# EAGLE design CBMINI (EAGLE 9.5.1)
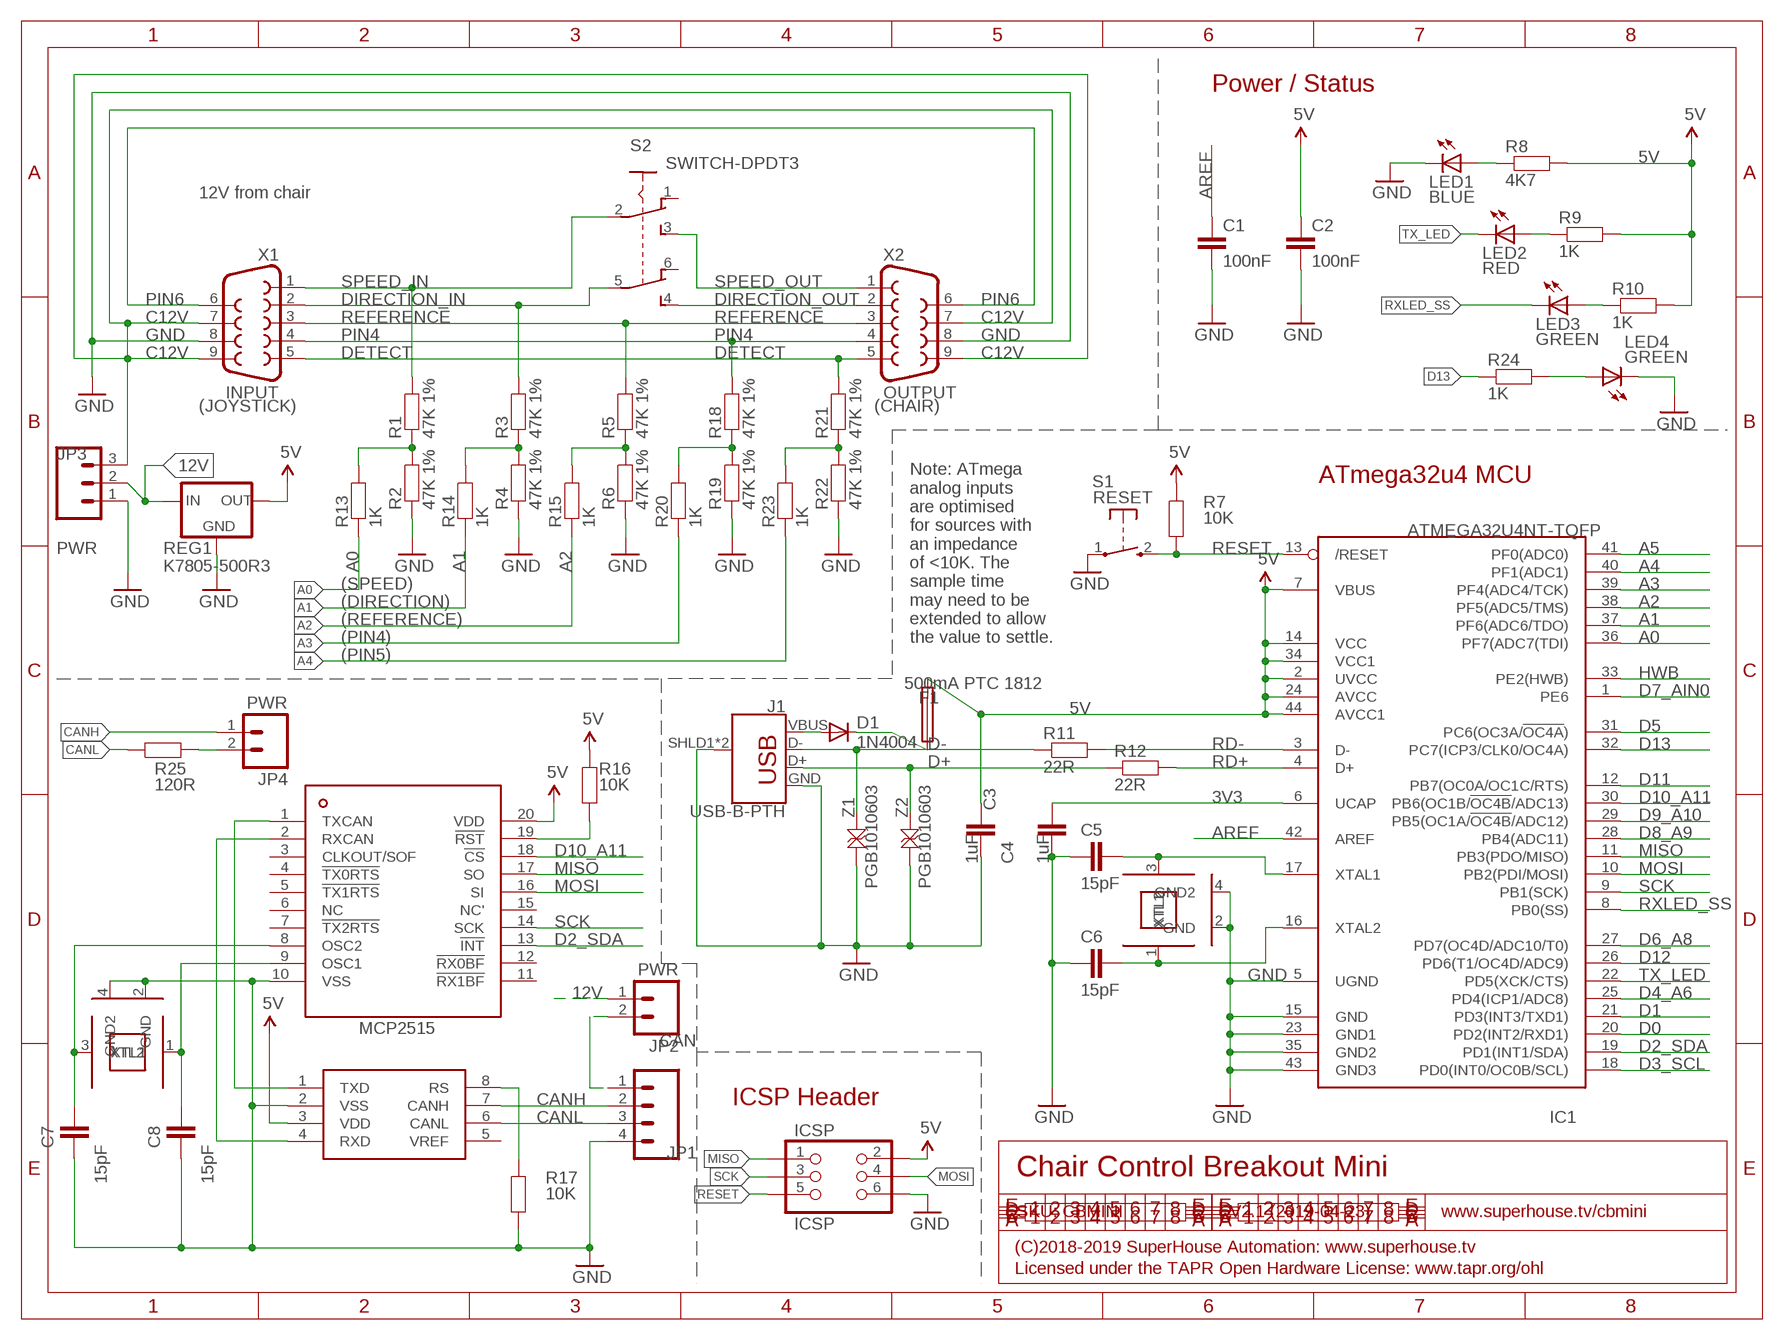
[diagram p0: schematic, sheet 1]

## Parts
C1  100nF  CAP0603  [C0603]
C2  100nF  CAP0603  [C0603]
C3  1uF  CAP0603  [C0603]
C4  1uF  CAP0603  [C0603]
C5  15pF  CAP0603  [C0603]
C6  15pF  CAP0603  [C0603]
C7  15pF  CAP0603  [C0603]
C8  15pF  CAP0603  [C0603]
D1  1N4004  DIODESMA  [SMA-DIODE]
F1  500mA PTC 1812  PTC050  [1812]
IC1  ATMEGA32U4NT-TQFP  [TQFP44]
IC2  MCP2515  [TSSOP20]
IC3  MCP2551  [SO08]
ICSP  ICSP  ICSP-PIN  [2X03-ICSP]
J1  USB-B-PTH  [USB-B-PTH]
JP1  CAN  M04-PIN  [1X04-P]
JP2  PWR  M02-PIN  [1X02-P]
JP3  PWR  M03-PIN  [1X03-P]
JP4  PWR  M02-PIN  [1X02-P]
LED1  BLUE  LED0603  [LED-0603]
LED2  RED  LED0603  [LED-0603]
LED3  GREEN  LED0603  [LED-0603]
LED4  GREEN  LED0603  [LED-0603]
R1  47K 1%  RESISTOR0603  [R0603]
R2  47K 1%  RESISTOR0603  [R0603]
R3  47K 1%  RESISTOR0603  [R0603]
R4  47K 1%  RESISTOR0603  [R0603]
R5  47K 1%  RESISTOR0603  [R0603]
R6  47K 1%  RESISTOR0603  [R0603]
R7  10K  RESISTOR0603  [R0603]
R8  4K7  RESISTOR0603  [R0603]
R9  1K  RESISTOR0603  [R0603]
R10  1K  RESISTOR0603  [R0603]
R11  22R  RESISTOR0603  [R0603]
R12  22R  RESISTOR0603  [R0603]
R13  1K  RESISTOR0603  [R0603]
R14  1K  RESISTOR0603  [R0603]
R15  1K  RESISTOR0603  [R0603]
R16  10K  RESISTOR0603  [R0603]
R17  10K  RESISTOR0603  [R0603]
R18  47K 1%  RESISTOR0603  [R0603]
R19  47K 1%  RESISTOR0603  [R0603]
R20  1K  RESISTOR0603  [R0603]
R21  47K 1%  RESISTOR0603  [R0603]
R22  47K 1%  RESISTOR0603  [R0603]
R23  1K  RESISTOR0603  [R0603]
R24  1K  RESISTOR0603  [R0603]
R25  120R  RESISTOR0603  [R0603]
REG1  K7805-500R3  K78XX-500R3  [K78XX-500R3]
S1  RESET  TAC_SWITCH_2PINSMT  [TACTILE_SMT_3X4X2]
S2  SWITCH-DPDT3  [7201SD9AV2BE]
X1  INPUT  DB9MALE  [DB9_MALE]
X2  OUTPUT  DB9FEMALE  [DB9]
XTL1  16MHz  CRYSTAL-GND3X2  [CRYSTAL-SMD-3X2]
XTL2  16MHz  CRYSTAL-GND3X2  [CRYSTAL-SMD-3X2]
Z1  PGB1010603  TVS0603  [TVS0603]
Z2  PGB1010603  TVS0603  [TVS0603]

## Nets
3V3: C4.2 IC1.6(UCAP)
5V: C2.1 C3.1 F1.2 IC1.2(UVCC) IC1.7(VBUS) IC1.14(VCC) IC1.24(AVCC) IC1.34(VCC1) IC1.44(AVCC1) IC2.20(VDD) IC3.3(VDD) ICSP.2 R7.2 R8.2 R9.2 R10.2 R16.2 REG1.3(OUT)
12V: JP2.1 JP3.2 REG1.1(IN)
A0: IC1.36(PF7(ADC7(TDI)) R13.1
A1: IC1.37(PF6(ADC6/TDO)) R14.1
A2: IC1.38(PF5(ADC5/TMS)) R15.1
A3: IC1.39(PF4(ADC4/TCK)) R20.1
A4: IC1.40(PF1(ADC1)) R23.1
A5: IC1.41(PF0(ADC0))
AREF: C1.1 IC1.42(AREF)
C12V: JP3.3 X1.7 X1.9 X2.7 X2.9
CANH: IC3.7(CANH) JP1.2 JP4.1
CANL: IC3.6(CANL) JP1.3 R25.1
D0: IC1.20(PD2(INT2/RXD1))
D1: IC1.21(PD3(INT3/TXD1))
D2_SDA: IC1.19(PD1(INT1/SDA)) IC2.13(!INT)
D3_SCL: IC1.18(PD0(INT0/OC0B/SCL))
D4_A6: IC1.25(PD4(ICP1/ADC8))
D5: IC1.31(PC6(OC3A/!OC4A!))
D6_A8: IC1.27(PD7(OC4D/ADC10/T0))
D7_AIN0: IC1.1(PE6)
D8_A9: IC1.28(PB4(ADC11))
D9_A10: IC1.29(PB5(OC1A/!OC4B!/ADC12))
D10_A11: IC1.30(PB6(OC1B/!OC4B!/ADC13)) IC2.18(!CS)
D11: IC1.12(PB7(OC0A/OC1C/RTS))
D12: IC1.26(PD6(T1/OC4D/ADC9))
D13: IC1.32(PC7(ICP3/CLK0/OC4A)) R24.1
D+: J1.D+ R12.1 Z2.2
D-: J1.D- R11.1 Z1.2
DETECT: R21.2 X1.5 X2.5
DIRECTION_IN: R3.2 S2.5 X1.2
DIRECTION_OUT: S2.4 X2.2
GND: C1.2 C2.2 C3.2 C4.1 C5.1 C6.1 C7.1 C8.1 IC1.5(UGND) IC1.15(GND) IC1.23(GND1) IC1.35(GND2) IC1.43(GND3) IC2.10(VSS) IC3.2(VSS) ICSP.6 J1.GND J1.SHLD1(SHIELD) J1.SHLD2(SHIELD) JP1.4 JP3.1 LED1.C LED4.C R2.1 R4.1 R6.1 R17.1 R19.1 R22.1 REG1.2(GND) S1.1(P) X1.8 X2.8 XTL1.2(GND) XTL1.4(GND2) XTL2.2(GND) XTL2.4(GND2) Z1.1 Z2.1
HWB: IC1.33(PE2(HWB))
MISO: IC1.11(PB3(PDO/MISO)) IC2.17(SO) ICSP.1
MOSI: IC1.10(PB2(PDI/MOSI)) IC2.16(SI) ICSP.4
N$1: LED4.A R24.2
N$2: R1.1 R2.2 R13.2
N$3: R3.1 R4.2 R14.2
N$4: R5.1 R6.2 R15.2
N$5: LED1.A R8.1
N$7: LED2.A R9.1
N$8: LED3.A R10.1
N$9: IC2.1(TXCAN) IC3.1(TXD)
N$10: IC2.19(!RST) R16.1
N$11: C5.2 IC1.17(XTAL1) XTL1.3(XTL2)
N$12: C6.2 IC1.16(XTAL2) XTL1.1(XTL1)
N$13: IC2.2(RXCAN) IC3.4(RXD)
N$14: C8.2 IC2.9(OSC1) XTL2.1(XTL1)
N$15: JP1.1 JP2.2
N$16: IC3.8(RS) R17.2
N$17: D1.C F1.1
N$18: C7.2 IC2.8(OSC2) XTL2.3(XTL2)
N$19: R18.1 R19.2 R20.2
N$20: JP4.2 R25.2
N$21: R21.1 R22.2 R23.2
PIN4: R18.2 X1.4 X2.4
PIN6: X1.6 X2.6
RD+: IC1.4(D+) R12.2
RD-: IC1.3(D-) R11.2
REFERENCE: R5.2 X1.3 X2.3
RESET: IC1.13(/RESET) ICSP.5 R7.1 S1.2(S)
RXLED_SS: IC1.8(PB0(SS)) LED3.C
SCK: IC1.9(PB1(SCK)) IC2.14(SCK) ICSP.3
SPEED_IN: R1.2 S2.2 X1.1
SPEED_OUT: S2.3 X2.1
TX_LED: IC1.22(PD5(XCK/CTS)) LED2.C
USB+: D1.A J1.VBUS
Unconnected: IC2.3(CLKOUT/SOF) IC2.4(!TX0RTS) IC2.5(!TX1RTS) IC2.6(NC) IC2.7(!TX2RTS) IC2.11(!RX1BF) IC2.12(!RX0BF) IC2.15(NC') IC3.5(VREF) S2.1 S2.6

## Notes on the sheet
- Power / Status
- 12V from chair
- (JOYSTICK) | (CHAIR)
- ATmega32u4 MCU
- (SPEED)
- (DIRECTION)
- (REFERENCE)
- (PIN4)
- Note: ATmega
  analog inputs
  are optimised
  for sources with
  an impedance
  of <10K. The
  sample time
  may need to be
  extended to allow
  the value to settle.
- (PIN5)
- ICSP Header
- Chair Control Breakout Mini
- SKU: CBMINI | V2.1 (2019-04-23) | www.superhouse.tv/cbmini
- (C)2018-2019 SuperHouse Automation: www.superhouse.tv
- Licensed under the TAPR Open Hardware License: www.tapr.org/ohl

## Library data of the parts
C1-C8 = SuperHouse-DiscreteSemi:CAP: Capacitor Standard ceramic capacitor
D1 = SuperHouse-DiscreteSemi:DIODE: Diode Standard reverse protection diodes and small signal diodes. SMA package can handle up to about 1A. SOD-323 can handle about 200mA.
F1 = SuperHouse-Fuses:PTC: MF-SMDF Series - PRC Resettable Fuses Source: http://www.farnell.com/datasheets/716597.pdf
IC1 = SuperHouse-MCUs:ATMEGA32U4NT: ATmega32u4 MCU
IC2 = SuperHouse-ICs:MCP2515: Microchip Technology’s MCP2515 is a stand-alone Controller Area Network (CAN) controller that implements the CAN specification, version 2.0B. It is capable of transmitting and receiving both standard and extended data and remote frames. The MCP2515 has two acceptance masks and six acceptance filters that are used to filter out unwanted messages, thereby reducing the host MCUs overhead. The MCP2515 interfaces with microcontrollers (MCUs) via an industry standard Serial Peripheral Interface (SPI).
IC3 = SuperHouse-ICs:MCP2551: CAN bus transceiver. Pin compatible chips with different specs include: MCP2551 (5V only) TCAN332DR (3.3V)
ICSP = SuperHouse-Connectors:ICSP
J1 = SuperHouse-Connectors:USB-B: USB Type B Connector
JP1 = SuperHouse-Connectors:M04: 4-way header Standard 1x4 header, and screw terminal variations
JP2 JP4 = SuperHouse-Connectors:M02: 2-way header Standard 1x2 header, and screw terminal variations
JP3 = SuperHouse-Connectors:M03: 3-way header Standard 1x3 header, and screw terminal variations
LED1-LED4 = SuperHouse-LEDs:LED: LEDs Standard schematic elements and footprints for 5mm, 3mm, 1206, and 0603 sized LEDs. 5mm - Spark Fun Electronics SKU : COM-00529 (and others)
R1-R25 = SuperHouse-DiscreteSemi:RESISTOR: Resistor Standard resistors.
REG1 = SuperHouse-Regulators:K78XX-500R3: K78xx-500R3 switchmode voltage regulator
S1 = SuperHouse-Switches:TAC_SWITCH_2PIN: Momentary Tactile Switch - 2 pin Uxcell 3x4x2mm switch with 2 SMT pads
S2 = freetronics-jon:SWITCH-DPDT
X1 X2 = SparkFun-Connectors:DB9: DB9 Connector Standard DB9 (D-Sub 9) serial connector. Can be used for CAN bus as well as RS485 and RS232. Footprint production proven. Spark Fun Electronics SKU : PRT-00429
XTL1 XTL2 = SuperHouse-Oscillators:CRYSTAL-GND: 3x2mm SMT crystal
Z1 Z2 = SuperHouse-DiscreteSemi:TVS: TVS voltage protection Zener

## Board
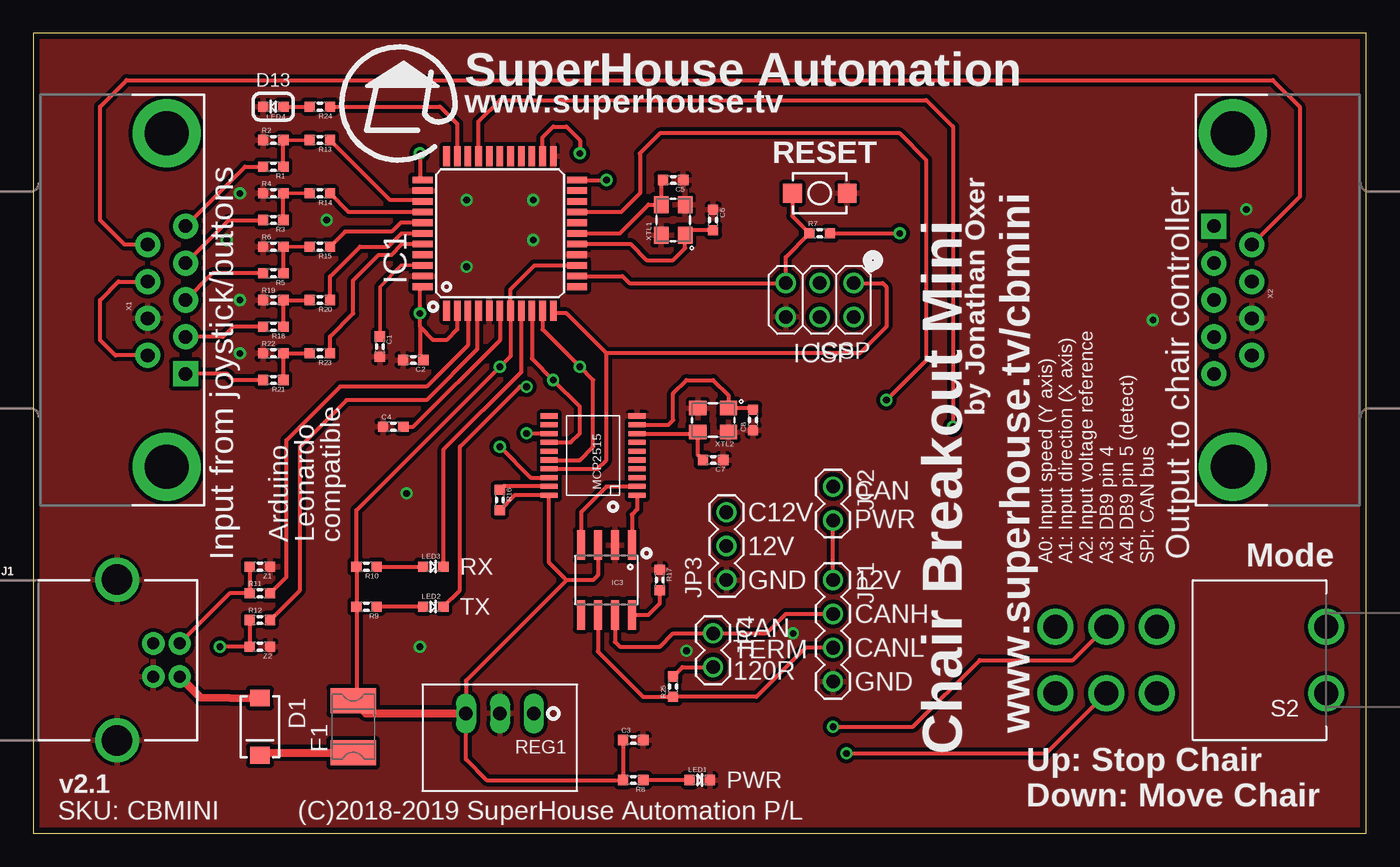
[diagram p1: board, top side]
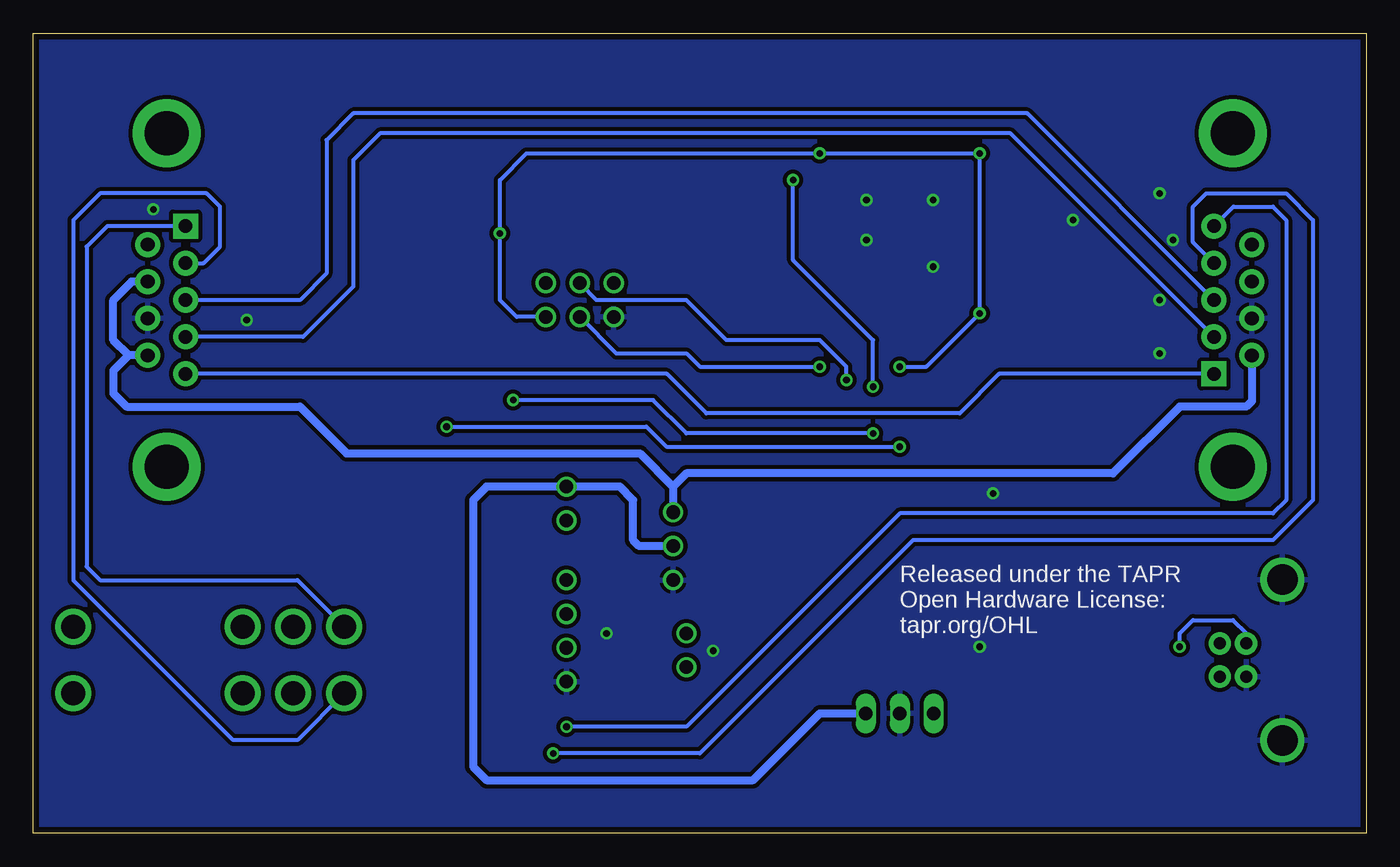
[diagram p2: board, bottom side, seen from below]

Size 100 x 60 mm. Coordinates in mm from the lower left corner, seen from the top.
Outline: 100,60 0,60 0,0 100,0 100,60
Copper layers (1*16): Top 0.035mm / dielectric 1.5mm / Bottom 0.035mm
Design rules "default *": minimum track width 10mil, minimum drill 24mil, track to track 12mil, track to pad 12mil, pad to pad 12mil, via to via 12mil, smd to smd 8mil, copper to edge 18mil, drill to drill 8mil, minimum pad ring 10mil, minimum via ring 8mil, stop-mask expansion 4mil, vias tented up to drill 0mil, thermal gap 10mil

### Footprints (pad centres in the part's own frame; a part is rotated, then mirrored left to right if it is on the bottom)
C0603 = smd 0.762 x 0.762: 1 -0.762,0; 2 0.762,0
SMA-DIODE = smd 1.27 x 1.47: A -2.15,0; C 2.15,0
1812 = smd 1.9 x 3.4: 1 -1.95,0; 2 1.95,0
TQFP44 = smd 1.5 x 0.5: 1 -5.8,4; 2 -5.8,3.2; 3 -5.8,2.4; 4 -5.8,1.6; 5 -5.8,0.8; 6 -5.8,0; 7 -5.8,-0.8; 8 -5.8,-1.6; 9 -5.8,-2.4; 10 -5.8,-3.2; 11 -5.8,-4; 23 5.8,-4; 24 5.8,-3.2; 25 5.8,-2.4; 26 5.8,-1.6; 27 5.8,-0.8; 28 5.8,0; 29 5.8,0.8; 30 5.8,1.6; 31 5.8,2.4; 32 5.8,3.2; 33 5.8,4 | smd 0.5 x 1.5: 12 -4,-5.8; 13 -3.2,-5.8; 14 -2.4,-5.8; 15 -1.6,-5.8; 16 -0.8,-5.8; 17 0,-5.8; 18 0.8,-5.8; 19 1.6,-5.8; 20 2.4,-5.8; 21 3.2,-5.8; 22 4,-5.8; 34 4,5.8; 35 3.2,5.8; 36 2.4,5.8; 37 1.6,5.8; 38 0.8,5.8; 39 0,5.8; 40 -0.8,5.8; 41 -1.6,5.8; 42 -2.4,5.8; 43 -3.2,5.8; 44 -4,5.8
TSSOP20 = smd 1.27 x 0.381: 1 -3.302,2.642; 2 -3.302,1.981; 3 -3.302,1.321; 4 -3.302,0.66; 5 -3.302,0; 6 -3.302,-0.66; 7 -3.302,-1.321; 8 -3.302,-1.981; 9 -3.302,-2.642; 10 -3.302,-3.302; 11 3.302,-3.302; 12 3.302,-2.642; 13 3.302,-1.981; 14 3.302,-1.321; 15 3.302,-0.66; 16 3.302,0; 17 3.302,0.66; 18 3.302,1.321; 19 3.302,1.981; 20 3.302,2.642
SO08 = smd 0.61 x 2.21: 1 -1.905,-2.616; 2 -0.635,-2.616; 3 0.635,-2.616; 4 1.905,-2.616; 5 1.905,2.616; 6 0.635,2.616; 7 -0.635,2.616; 8 -1.905,2.616
2X03-ICSP = drill 1.016: 1 -2.54,-1.27; 2 -2.54,1.27; 3 0,-1.27; 4 0,1.27; 5 2.54,-1.27; 6 2.54,1.27
USB-B-PTH = drill 0.914 pad 1.676: D+ 4,1.25; D- 5.981,1.25; GND 4,-1.25; VBUS 5.981,-1.25 | drill 2.286: SHLD1 1.282,-6.02; SHLD2 1.282,6.02
1X04-P = drill 1.016: 1 0,0; 2 2.54,0; 3 5.08,0; 4 7.62,0
1X02-P = drill 1.016: 1 0,0; 2 2.54,0
1X03-P = drill 1.016: 1 0,0; 2 2.54,0; 3 5.08,0
LED-0603 = smd 0.762 x 0.762: A -0.762,0; C 0.762,0
R0603 = smd 0.762 x 0.762: 1 -0.762,0; 2 0.762,0
K78XX-500R3 = drill 1 long: 1 -2.54,0; 2 0,0; 3 2.54,0
TACTILE_SMT_3X4X2 = smd 1.4 x 1.4: 1 -2.05,0; 2 2.05,0
7201SD9AV2BE = drill 1.8: 1 12.7,-2.5; 2 16.51,-2.5; 3 20.32,-2.5; 4 20.32,2.5; 5 16.51,2.5; 6 12.7,2.5; 7 0,2.5; 8 0,-2.5
DB9_MALE = drill 1.016 pad 1.88: 1 5.54,-1.42; 2 2.77,-1.42; 3 0,-1.42; 4 -2.77,-1.42; 6 4.15,1.42; 7 1.38,1.42; 8 -1.38,1.42; 9 -4.15,1.42 | drill 1.016 pad 1.88 square: 5 -5.54,-1.42 | drill 3.302 pad 5.08: G1 -12.5,0; G2 12.5,0
DB9 = drill 1.016 pad 1.88 square: 1 -5.54,-1.42 | drill 1.016 pad 1.88: 2 -2.77,-1.42; 3 0,-1.42; 4 2.77,-1.42; 5 5.54,-1.42; 6 -4.15,1.42; 7 -1.38,1.42; 8 1.38,1.42; 9 4.15,1.42 | drill 3.302 pad 5.08: G1 -12.5,0; G2 12.5,0
CRYSTAL-SMD-3X2 = smd 1.3 x 1.1: 1 -1.15,-0.9; 2 1.15,-0.9; 3 1.15,0.9; 4 -1.15,0.9
TVS0603 = smd 0.762 x 0.762: 1 -0.762,0; 2 0.762,0

### Placement (x,y rotation side)
C1  26,36.5 270 top
C2  28.5,35.5 180 top
C3  45,7 0 top
C4  27,30.5 0 top
C5  48,49 180 top
C6  51,46 270 top
C7  51,28 180 top
C8  54,31 90 top
D1  17,8 270 top
F1  24,8 90 top
IC1  35,45 90 top
IC2  42,28 180 top
IC3  43,19 180 top
ICSP  59,40 180 top
J1  5,13 0 top
JP1  60,19 270 top
JP2  60,26 270 top
JP3  52,19 90 top
JP4  51,15 270 top
LED1  50,4 0 top
LED2  30,17 0 top
LED3  30,20 0 top
LED4  18,54.5 180 top
R1  18,50 180 top
R2  18,52 0 top
R3  18,46 180 top
R4  18,48 0 top
R5  18,42 180 top
R6  18,44 0 top
R7  59,45 0 top
R8  45,4 180 top
R9  25,17 180 top
R10  25,20 180 top
R11  17,18 0 top
R12  17,16 0 top
R13  21.5,52 180 top
R14  21.5,48 180 top
R15  21.5,44 180 top
R16  35,25 270 top
R17  47,19 270 top
R18  18,38 180 top
R19  18,40 0 top
R20  21.5,40 180 top
R21  18,34 180 top
R22  18,36 0 top
R23  21.5,36 180 top
R24  21.5,54.5 180 top
R25  48,11 90 top
REG1  35,9 180 top
S1  59,48 180 top
S2  97,13 180 top
X1  10,40 90 top
X2  90,40 270 top
XTL1  48,46 90 top
XTL2  51,31 180 top
Z1  17,20 180 top
Z2  17,14 180 top

### Tracks (layer width: path | path; a pad name or v marks a point on that pad's centre or on a via)
3V3
  Top 0.305: C4.2 28.5,30.5 35,37 IC1.6
5V  (via drill 0.5)
  Top 0.305: 29,38 30,37 31,37 31.8,37.8 IC1.2 | 29,38 v29,39 29,40.8 IC1.44 | R16.2 36.12,25.36 IC2.20 38.7,20.3 40,19 | IC3.3 42.37,19.36 42,19 40,19 | 29,38 29,35.76 C2.1 | v29,51 29,49.2 IC1.34 | IC1.24 38.2,52.2 39,53 40,53 41,52 v41,51 | R7.2 v65,45 | IC1.14 37.6,42.6 35.8,40.8 IC1.7 35.8,35.8 v35,35 24.24,24.24 R10.2 R9.2 24.24,10.19 F1.2 | 40,19 32.46,11.46 REG1.3 32.46,5.54 34,4 R8.2 C3.1
  Top 0.61: F1.2 24.95,9 REG1.3
  Bottom 0.305: ICSP.2 63.73,38.73 65,40 v65,45 65,49 63,51 v41,51 v29,51 v29,39 33,35 v35,35
12V
  Bottom 0.61: JP3.2 54.54,21.54 55,22 55,25 56,26 JP2.1 66,26 67,25 67,5 66,4 46,4 41,9 REG1.1
A0
  Top 0.305: IC1.36 29.11,47.49 26.77,47.49 R13.1
A1
  Top 0.305: IC1.37 23.66,46.6 R14.1
A2
  Top 0.305: IC1.38 27.56,45.8 26.88,45.12 23.38,45.12 R15.1
A3
  Top 0.305: R20.1 22.26,41.76 24.5,44 26.62,44 27.62,45 IC1.39
A4
  Top 0.305: R23.1 22.26,37.26 24,39 24,41.5 25.89,43.39 26.88,43.39 27.69,44.2 IC1.40
AREF
  Top 0.254: C1.1 26,41 27.6,42.6 IC1.42
C12V
  Top 0.305: X1.9 6.15,35.85 5,37 5,40 6.38,41.38 X1.7
  Bottom 0.61: X1.9 8.58,32.42 9,32 14,32 19,27 51,27 52,26 | X2.7 92.62,41.38 94,40 94,37 92.85,35.85 | X2.9 92.85,35.85 | 92.85,35.85 94,34.7 94,33 93,32 80,32 76.5,28.5 54.5,28.5 52,26 | 52,26 JP3.3
CANH
  Top 0.305: IC3.7 43.63,14.37 44,14 47,14 48,15 JP4.1 55,15 56.46,16.46 JP1.2
CANL
  Top 0.305: IC3.6 42.37,13.63 45.76,10.24 R25.1 54.24,10.24 57.92,13.92 JP1.3
D2_SDA  (via drill 0.5)
  Top 0.305: IC2.13 37.02,29.98 v37,30 | v64,32.5 67,35.5 67,50.5 65,52.5 47,52.5 45.5,51 45.5,48 44.1,46.6 IC1.19
  Bottom 0.305: v64,32.5 53.5,32.5 51,30 v37,30
D10_A11  (via drill 0.5)
  Top 0.305: IC1.30 33.4,53.4 35,55 67,55 69,53 v69,30.5 | v35,29 37.32,26.68 IC2.18
  Bottom 0.305: v35,29 52.5,29 54,30.5 v69,30.5
D13
  Top 0.305: R24.1 30.5,54.5 31.8,53.2 IC1.32
D+  (via drill 0.5)
  Top 0.305: R12.1 Z2.2 v14,14
  Bottom 0.305: v14,14 14,15 13,16 10,16 9,15 J1.D+
D-
  Top 0.305: Z1.2 R11.1 14.73,18 J1.D-
DETECT
  Top 0.305: R21.2 15,34 14.54,34.46 X1.5
  Bottom 0.305: X1.5 27.54,34.46 30.5,31.5 49.5,31.5 52.46,34.46 X2.5
DIRECTION_IN  (via drill 0.5)
  Top 0.305: X1.2 14.65,46 R3.2 | S2.5 75.99,6 v61,6
  Bottom 0.305: X1.2 13,44.35 13,47 12,48 6,48 4,46 4,25 7,22 34,22 50,6 v61,6
DIRECTION_OUT
  Bottom 0.305: X2.2 87.23,42.77 86,44 86,47 87,48 95,48 97,46 97,19 85,7 80.18,7 S2.4
GND  (via drill 0.5)
  other vias: 32.5,47.5 32.5,42.5 37.5,47.5 37.5,44.5 29,14 15.5,48 22,46 28,25.5 84,38.5 14.5,44.5 15.5,40 15.5,36 57,15 49,13.7 91,46.8
  pour Bottom: 100,0 0,0 0,60 100,60
  pour Top: 100,0 0,0 0,60 100,60
MISO
  Top 0.305: 43,36 43,28 42.34,27.34 IC2.17 | ICSP.1 63.73,41.27 64,41 64,38 62,36 43,36 | IC1.11 39.2,39 40,39 43,36
MOSI  (via drill 0.5)
  Top 0.305: IC2.16 41,28 42,29 42,34 v41,35 38.2,37.8 IC1.10
  Bottom 0.305: ICSP.4 56.27,36 51,36 50,35 v41,35
N$1
  Top 0.305: LED4.A R24.2
N$2
  Top 0.254: R2.2 R13.2
  Top 0.305: R1.1 R2.2
N$3
  Top 0.254: R4.2 R14.2
  Top 0.305: R3.1 R4.2
N$4
  Top 0.254: R6.2 R15.2
  Top 0.305: R6.2 R5.1
N$5
  Top 0.305: LED1.A R8.1
N$7
  Top 0.305: LED2.A R9.1
N$8
  Top 0.305: R10.1 LED3.A
N$9
  Top 0.305: IC3.1 44.91,23.91 45.3,24.3 IC2.1
N$10
  Top 0.305: IC2.19 35.26,26.02 R16.1
N$11
  Top 0.305: C5.2 47.1,48.86 XTL1.3 46.15,47.15 44,45 IC1.17
N$12
  Top 0.305: C6.2 49.29,45.24 XTL1.1 48.9,43.9 48,43 46,43 44.8,44.2 IC1.16
N$13
  Top 0.305: IC3.4 41.09,24.09 43.01,26.01 45.29,26.01 IC2.2
N$14
  Top 0.305: C8.2 53.86,31.9 XTL2.1 52.15,32.85 51,34 49,34 48,33 48,31 47.64,30.64 IC2.9
N$15
  Top 0.305: JP1.1 JP2.2
N$16
  Top 0.305: IC3.8 46.15,16.38 47,17.24 R17.2
N$17
  Top 0.61: D1.C 17.25,6.05 F1.1
N$18
  Top 0.305: C7.2 49.85,28.39 XTL2.3 49.73,29.98 IC2.8
N$19
  Top 0.305: R18.1 R19.2 R20.2
N$20
  Top 0.305: R25.2 48.7,12.46 JP4.2
N$21
  Top 0.305: R23.2 R22.2 R21.1
PIN4
  Top 0.305: R18.2 15,38 14.23,37.23 X1.4
  Bottom 0.305: X2.4 79.77,37.23 76,41 76,50.5 74,52.5 26.69,52.5 X1.4
PIN6
  Top 0.305: X1.6 6.85,44.15 5,46 5,54.5 7,56.5 93,56.5 95,54.5 95,47.73 X2.6
RD+
  Top 0.305: R12.2 20,18.24 20,29 23.5,32.5 29.5,32.5 33.31,36.31 33.31,39.11 IC1.4
RD-
  Top 0.305: R11.2 19,19.24 19,29.5 23,33.5 29.5,33.5 32.6,36.6 IC1.3
REFERENCE
  Top 0.305: R5.2 13.42,42 X1.3
  Bottom 0.305: X2.3 80,40 78,42 78,52 76,54 25.42,54 X1.3
RESET
  Top 0.305: S1.2 56.95,46.29 R7.1 56.46,43.22 ICSP.5 44.73,41.27 44.2,41.8 IC1.13
RXLED_SS
  Top 0.305: LED3.C 30.76,28.76 36.6,34.6 IC1.8
SCK  (via drill 0.5)
  Top 0.305: IC2.14 40.32,29.32 41,30 41,32 v39,34 37.4,35.6 IC1.9
  Bottom 0.305: ICSP.3 57.73,40 51,40 48,37 41,37 39,35 v39,34
SPEED_IN  (via drill 0.5)
  Top 0.305: X1.1 15.88,50 R1.2 | v60,8 66,8 71,13 77.99,13 S2.2
  Bottom 0.305: X1.1 9.96,47 7,47 6,46 6,25 7,24 35,24 51,8 v60,8
SPEED_OUT
  Bottom 0.305: X2.1 90.83,45.54 90.84,45.55 94.45,45.55 96,44 96,20 95,19 80.18,19 S2.3
TX_LED  (via drill 0.5)
  Top 0.305: LED2.C 32,18.24 32,29 36.5,33.5 v37,33.5 | IC1.22 v43,49
  Bottom 0.305: v37,33.5 37,37 43,43 v43,49
USB+
  Top 0.61: J1.VBUS 12.53,10.2 D1.A

### Text on the board
tPlace: D13 | SuperHouse Automation | www.superhouse.tv | RESET | ICSP | by Jonathan Oxer | CAN / PWR | C12V | Arduino / Leonardo / compatible | 12V | Output to chair controller | Input from joystick/buttons | RX | A0: Input speed (Y axis) / A1: Input direction (X axis) / A2: Input voltage reference / A3: DB9 pin 4 / A4: DB9 pin 5 (detect) / SPI: CAN bus | Mode | GND | 12V | TX | CANH | CAN | TERM | CANL | 120R | GND | www.superhouse.tv/cbmini | Chair Breakout Mini | PWR | v2.1 | Up: Stop Chair / Down: Move Chair | SKU: CBMINI | (C)2018-2019 SuperHouse Automation P/L
bPlace: Released under the TAPR / Open Hardware License: / tapr.org/OHL